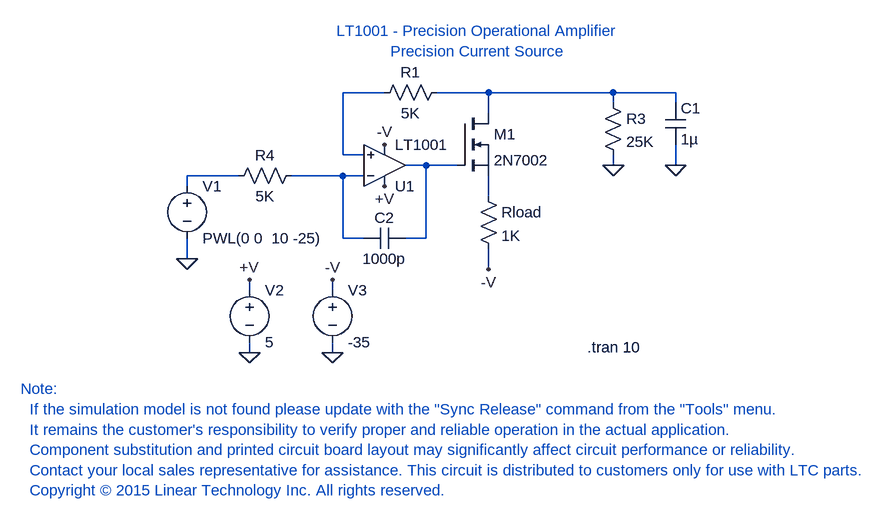
[diagram p0: schematic LT1001_TA05.asc]
LT1001_TA05.asc, the LTspice schematic file:
Version 4
SHEET 1 1136 680
WIRE 32 48 -32 48
WIRE 192 48 112 48
WIRE 384 48 192 48
WIRE 480 48 384 48
WIRE 384 64 384 48
WIRE 480 64 480 48
WIRE 192 80 192 48
WIRE -32 144 -32 48
WIRE 0 144 -32 144
WIRE 96 160 64 160
WIRE 144 160 96 160
WIRE 384 160 384 144
WIRE 480 160 480 128
WIRE -192 176 -272 176
WIRE -32 176 -112 176
WIRE 0 176 -32 176
WIRE -272 192 -272 176
WIRE 192 208 192 176
WIRE -32 272 -32 176
WIRE 0 272 -32 272
WIRE 96 272 96 160
WIRE 96 272 64 272
WIRE -272 304 -272 272
WIRE 192 320 192 288
WIRE -176 352 -176 336
WIRE -48 352 -48 336
WIRE -176 448 -176 432
WIRE -48 448 -48 432
FLAG -272 304 0
FLAG -176 448 0
FLAG -48 448 0
FLAG -176 336 +V
FLAG -48 336 -V
FLAG 32 192 +V
FLAG 32 128 -V
FLAG 480 160 0
FLAG 384 160 0
FLAG 192 320 -V
SYMBOL LT1001 32 224 M180
SYMATTR InstName U1
SYMBOL res 128 32 R90
WINDOW 0 0 56 VBottom 2
WINDOW 3 32 56 VTop 2
SYMATTR InstName R1
SYMATTR Value 5K
SYMBOL res 368 48 R0
SYMATTR InstName R3
SYMATTR Value 25K
SYMBOL cap 464 64 R0
SYMATTR InstName C1
SYMATTR Value 1µ
SYMBOL cap 64 256 R90
WINDOW 0 0 32 VBottom 2
WINDOW 3 32 32 VTop 2
SYMATTR InstName C2
SYMATTR Value 1000p
SYMBOL res -96 160 R90
WINDOW 0 0 56 VBottom 2
WINDOW 3 32 56 VTop 2
SYMATTR InstName R4
SYMATTR Value 5K
SYMBOL voltage -272 176 R0
WINDOW 123 0 0 Left 2
WINDOW 39 0 0 Left 2
SYMATTR InstName V1
SYMATTR Value PWL(0 0  10 -25)
SYMBOL res 176 192 R0
SYMATTR InstName Rload
SYMATTR Value 1K
SYMBOL voltage -176 336 R0
WINDOW 123 0 0 Left 2
WINDOW 39 0 0 Left 2
SYMATTR InstName V2
SYMATTR Value 5
SYMBOL voltage -48 336 R0
WINDOW 123 0 0 Left 2
WINDOW 39 0 0 Left 2
SYMATTR InstName V3
SYMATTR Value -35
SYMBOL nmos 144 80 R0
SYMATTR InstName M1
SYMATTR Value 2N7002
TEXT 344 440 Left 2 !.tran 10
TEXT 176 0 Bottom 2 ;LT1001 - Precision Operational Amplifier\nPrecision Current Source
TEXT -528 504 Left 2 ;Note:\n  If the simulation model is not found please update with the "Sync Release" command from the "Tools" menu.\n  It remains the customer's responsibility to verify proper and reliable operation in the actual application.\n  Component substitution and printed circuit board layout may significantly affect circuit performance or reliability.\n  Contact your local sales representative for assistance. This circuit is distributed to customers only for use with LTC parts.\n  Copyright © 2015 Linear Technology Inc. All rights reserved.

The netlist it stands for:
* LT1001_TA05.asc
XU1 N001 N005 +V -V N003 LT1001  ; pins In+ In- V+ V- OUT
R1 N002 N001 5K
R3 N002 0 25K
C1 N002 0 1µ
C2 N003 N005 1000p
R4 N005 N004 5K
V1 N004 0 PWL(0 0  10 -25)
Rload N006 -V 1K
V2 +V 0 5
V3 -V 0 -35
M1 N002 N003 N006 N006 2N7002
.model NMOS NMOS
.model PMOS PMOS
.lib standard.mos
.tran 10
* LT1001 - Precision Operational Amplifier
* Precision Current Source
* Note:
*   If the simulation model is not found please update with the "Sync Release" command from the "Tools" menu.
*   It remains the customer's responsibility to verify proper and reliable operation in the actual application.
*   Component substitution and printed circuit board layout may significantly affect circuit performance or reliability.
*   Contact your local sales representative for assistance. This circuit is distributed to customers only for use with LTC parts.
*   Copyright © 2015 Linear Technology Inc. All rights reserved.
.lib LTC.lib
.backanno
.end